# EAGLE schematic NJM2396 (EAGLE 7.2.0)
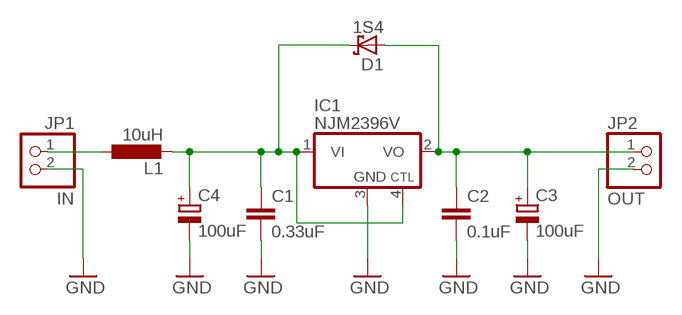
[diagram p0: schematic, sheet 1]

## Parts
C1  0.33uF  C-EU050-030X075  [C050-030X075]
C2  0.1uF  C-EU025-024X044  [C025-024X044]
C3  100uF  CPOL-EUSANYO_E13  [SANYO-OSCON_E13]
C4  100uF  CPOL-EUSANYO_E13  [SANYO-OSCON_E13]
D1  1S4  SCHOTTKY-DIODEDO35-7  [DO35-7]
IC1  NJM2396V  [TO220-4V]
JP1  IN  PINHD-1X2  [1X02]
JP2  OUT  PINHD-1X2  [1X02]
L1  10uH  L-EU6000-XXX-RC  [6000-XXXX-RC]

## Nets
GND: C1.2 C2.2 C3.- C4.- IC1.3(GND) JP1.2 JP2.2
N$1: C1.1 C4.+ D1.C IC1.1(VI) IC1.4(CTL) L1.2
N$2: C2.1 C3.+ D1.A IC1.2(VO) JP2.1
N$4: JP1.1 L1.1

## Library data of the parts
C1 C2 = rcl:C-EU: CAPACITOR, European symbol
C3 C4 = rcl:CPOL-EU: POLARIZED CAPACITOR, European symbol
D1 = diode:SCHOTTKY-DIODE: Schottky Diode
IC1 = mylib2:NJM2396V: NJM2936 Vertical 5V LDO
JP1 JP2 = pinhead:PINHD-1X2: PIN HEADER
L1 = rcl:L-EU: INDUCTOR, European symbol